# Altium project RFM_Temperature_1.0.1.PrjPCB
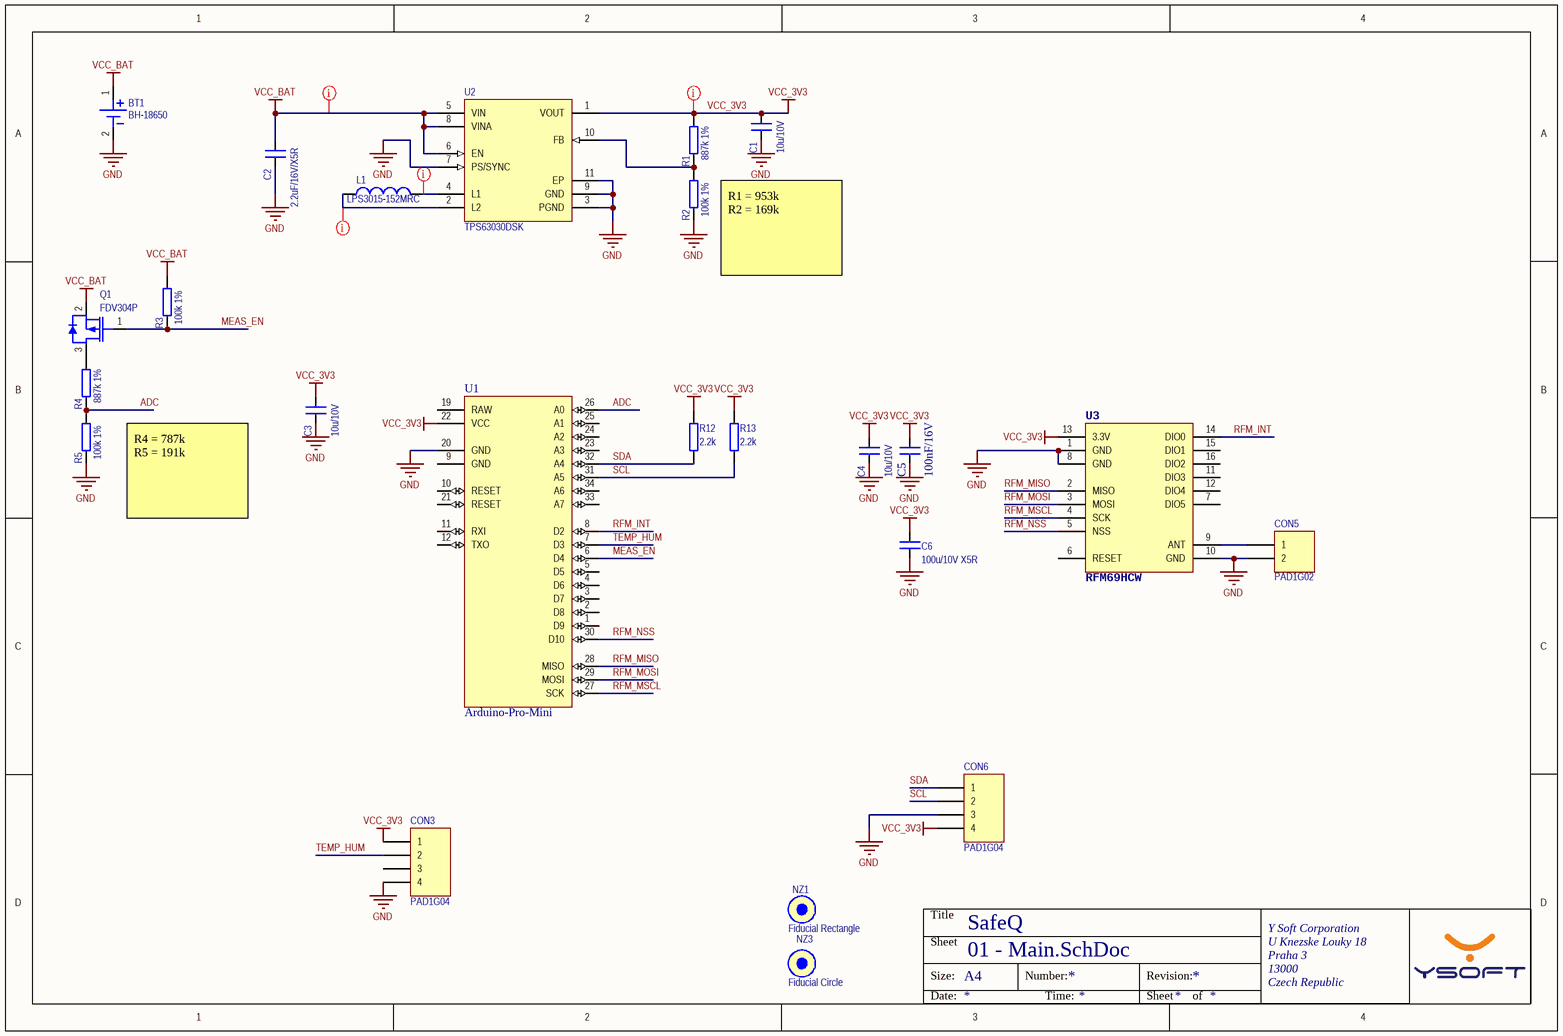
[diagram p0: 01 - Main.SchDoc]
Title: SafeQ; YSoftTitle: SafeQ
1 sheet, 24 parts. Net scope: global (net labels, ports and power ports of the same name join across sheets).
Board file: RFM_Temperature_1.0.1.PcbDoc

## Sheet 01 - Main.SchDoc: SafeQ
size A4; Organization: Y Soft Corporation; Address1: U Knezske Louky 18; Address2: Praha 3; Address3: 13000; Address4: Czech Republic

### Parts
BT1  BH-18650  [BH18650]
C1  10u/10V  [C-0805]
C2  2.2uF/16V/X5R  [C-0603]
C3  10u/10V  [C-0805]
C4  10u/10V  [C-0805]
C5  100nF/16V  [C-0603]
C6  100u/10V X5R  [C-1206]
CON3  PAD1G04  [HDR1X04S]
CON5  PAD1G02  [HDR1X02S]
CON6  PAD1G04  [HDR1X04S]
L1  LPS3015-152MRC  [LPS3015]
NZ1  Fiducial Rectangle  [Fiducial Rectangle]  (no BOM)
NZ3  Fiducial Circle  [Fiducial Circle]  (no BOM)
Q1  FDV304P  [SOT23-3L]
R1  887k 1%  [R-0603]
R2  100k 1%  [R-0603]
R3  100k 1%  [R-0603]
R4  887k 1%  [R-0603]
R5  100k 1%  [R-0603]
R12  2.2k  [R-0603]
R13  2.2k  [R-0603]
U1  Arduino-Pro-Mini  [Arduino Mini Pro]
U2  TPS63030DSK  [DSK10-2000X1200TP_V]
U3  RFM69HCW  [RFM69HCW-XXXS2]

### Nets
GND: BT1.2(-) C1.1 C2.1 C3.1 C4.1 C5.1 C6.1 CON3.4 CON5.2 CON6.3 R2.1 R5.1 U1.20(GND) U2.3(PGND) U2.7(PS/SYNC) U2.9(GND) U2.11(EP) U3.1(GND) U3.8(GND) U3.10(GND)
VCC_3V3: C1.2 C3.2 C4.2 C5.2 C6.2 CON3.1 CON6.4 R1.2 R12.2 R13.2 U1.22(VCC) U2.1(VOUT) U3.13(3.3V)
VCC_BAT: BT1.1(+) C2.2 Q1.2(SOURCE) R3.2 U2.5(VIN) U2.6(EN) U2.8(VINA)
ADC: R4.1 R5.2 U1.26(A0)
MEAS_EN: Q1.1(GATE) R3.1 U1.6(D4)
RFM_INT: U1.8(D2) U3.14(DIO0)
RFM_MISO: U1.28(MISO) U3.2(MISO)
RFM_MOSI: U1.29(MOSI) U3.3(MOSI)
RFM_MSCL: U1.27(SCK) U3.4(SCK)
RFM_NSS: U1.30(D10) U3.5(NSS)
SCL: CON6.2 R13.1 U1.31(A5)
SDA: CON6.1 R12.1 U1.32(A4)
TEMP_HUM: CON3.2 U1.7(D3)
NetCON5_1: CON5.1 U3.9(ANT)
NetL1_1: L1.1 U2.2(L2)
NetL1_2: L1.2 U2.4(L1)
NetQ1_3: Q1.3(DRAIN) R4.2
NetR1_1: R1.1 R2.2 U2.10(FB)

Not connected (* = marked no-connect by the designer): CON3 3; U1 1(D9) 2(D8) 3(D7) 4(D6) 5(D5) 9(GND) 10(RESET) 11(RXI) 12(TXO) 19(RAW) 21(RESET) 23(A3) 24(A2) 25(A1) 33(A7) 34(A6); U3 6(RESET) 7(DIO5) 11(DIO3) 12(DIO4) 15(DIO1) 16(DIO2)

### Layout directives
net class Power Net: NetL1_1, NetL1_2, VCC_3V3, VCC_BAT

### Notes on the sheet
- R1 = 953k
  R2 = 169k
- R4 = 787k
  R5 = 191k
- Title
- Size:
- Sheet
- A4
- Number:
- Revision:
- Date:
- Time:
- of

### Library data of the parts
C1 C3 C4 = CMP-00295-1: SMD Ceramic Capacitor 0805 10u/10V; Helios ID: C-0805 10u/10V; Type: SMT; Package: 0805
C2 = CMP-00265-1: SMD Ceramic Capacitor 0603 2.2uF/16V/X5R; Helios ID: C-0603 2.2uF/16V/X5R; Type: SMT; Package: 0603
C5 = CMP-00250-1: SMD Ceramic Capacitor 0603 100nF/16V; Helios ID: C-0603 100nF/16V; Type: SMT; Package: 0603
C6 = CMP-00294-4: SMD Ceramic Capacitor 1206 100u/10V X5R; Helios ID: C-1206 100u/10V X5R; Type: SMT; Package: 1206
CON3 CON6 = CMP-00006-3: 1x4pin single row pads, 2.54mm; Helios ID: KON-PAD1G04; Type: TH
CON5 = CMP-00005-1: 1x2pin single row pads, 2.54mm; Helios ID: KON-PAD1G02; LatestRevisionDate: 17-Jul-2002; LatestRevisionNote: Re-released for DXP Platform.; Publisher: Altium Limited; Type: TH
L1 = CMP-00325-2: Shielded inductor 1.5uH/1.3A 3x3mm; Helios ID: TLU-LPS3015-152MRC; Type: SMT; HelpURL: \\DCCZPRAH01\Shared\R&D\Documents\Coilcraft\lps3015.pdf
NZ1 = CMP-00041-2: Helios ID: x004; Type: MECH
NZ3 = CMP-00042-3: Helios ID: x005; Type: MECH
Q1 = CMP-00186-2: P-Channel Digital FET 25V, 460mA; Helios ID: TRA-FDV304P; Type: SMT; Package: SOT23; HelpURL: http://www.fairchildsemi.com/ds/FD/FDV304P.pdf
R1 R4 = CMP-00324-1: SMD Resistor 0603 887k 1%; Helios ID: R-0603 887k 1%; Value: 887k; Type: SMT; Package: 0603
R2 R3 R5 = CMP-00033-2: SMD Resistor 0603 100k 1%; Helios ID: R-0603 100k 1%; Value: 100k; Type: SMT; Package: 0603
R12 R13 = CMP-00080-2: SMD Resistor 0603 2k2; Helios ID: R-0603 2k2; Value: 2.2k; Type: SMT; Package: 0603
U2 = CMP-00323-3: High Efficient Single Inductor Buck-Boost Converter with 1-A Switches; Helios ID: IO-TPS63030DSKR; HelpURL: \\dcczprah01\Shared\R&D\Documents\Texas Instruments\tps63030.pdf; Package: PWSON10; Type: SMT

## Assembly variants
Prototype: not fitted C149 C151 C172 C173 CON3 CON4 R81 R82 R88 R89 R90 R92 R116 R117 R136 R137 R138 R139 R140 R141 R142 R143 R147
Final: not fitted C101 C103 C104 C105 C106 C107 C108 C109 C110 C112 C113 C114 C116 C117 C125 C126 C129 C135 C136 C149 C151 C172 C173 C208 C209 C211 C212 C213 C214 C215 C291 C292 C293 C294 C295 C296 C297 C298 C301 C302 C303 C304 C305 C306 C307 C308 C309 C315 C324 C343 C344 C345 C346 C? C? CON3 CON4 CON12 CON13 CON15 D7 J1 L12 R46 R47 R48 R49 R50 R51 R52 R53 R55 R58 R61 R81 R82 R88 R89 R90 R92 R105 R106 R107 R108 R109 R110 R112 R116 R117 R136 R137 R138 R139 R140 R141 R142 R143 R147 R150 R151 R? R? U12 U25 U26 U27 U28
Appliance: not fitted C136 C137 C138 C139 C149 C151 C158 C160 C161 C172 C173 C271 C272 C273 C274 C335 CON1 CON2 CON10 CON12 CON13 CON14 FB6 FB19 FB20 FB21 FB22 FB23 FB24 FB25 J3 J4 J5 Q7 R24 R24 R25 R25 R26 R26 R27 R28 R29 R30 R31 R32 R33 R35 R37 R73 R74 R81 R82 R88 R89 R90 R92 R116 R117 R136 R137 R138 R139 R140 R141 R142 R143 R147 R? U4 U5 U6 U7 U8 U18